# Altium schematic sheet 3.3V CAN_Tranceiver.SchDoc
size A
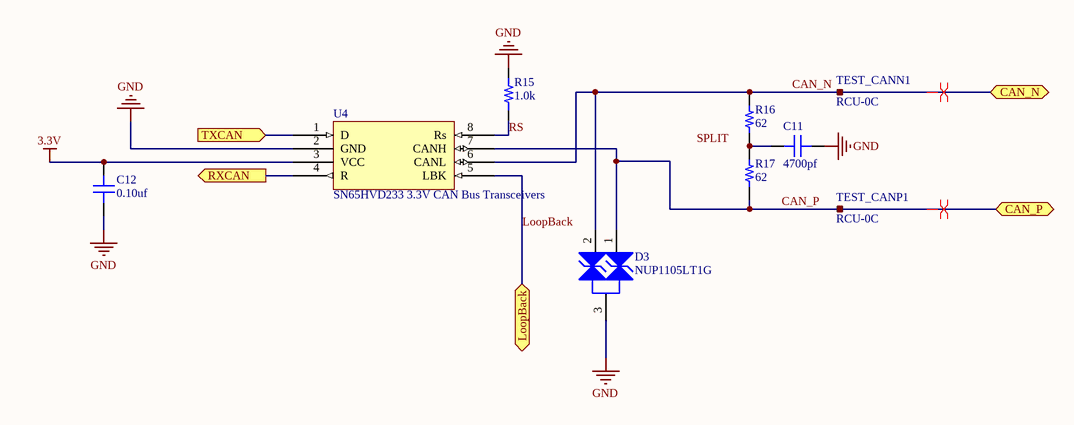
[diagram p0: 3.3V CAN_Tranceiver.SchDoc]

## Parts
C11  value 4700pf  [CAP 0603/1608]  (hidden comment: Capacitor MLCC 4700pf 50V CAP 0603/1608)
C12  value 0.10uf  [CAP 0603/1608]  (hidden comment: Capacitor MLCC 0.10uf 50V CAP 0603/1608)
D3  NUP1105LT1G  [SOT-23 (TO-236)]
R15  value 1.0k  [RES 0603/1608]  (hidden comment: Resistor 1.0k 0603 1/10W 1%)
R16  value 62  [RES 0603/1608]  (hidden comment: Resistor 62 0603 1/10W 5%)
R17  value 62  [RES 0603/1608]  (hidden comment: Resistor 62 0603 1/10W 5%)
TEST_CANN1  RCU-0C  [RCU-0C]
TEST_CANP1  RCU-0C  [RCU-0C]
U4  SN65HVD233 3.3V CAN Bus Transceivers  [SOIC-8]

## Ports
CAN_N (bidir), CAN_P (bidir), LoopBack (bidir), RXCAN (out), TXCAN (in)

## Nets
3.3V: C12.1 U4.3(VCC)
GND: C11.1 C12.2 D3.3(K) R15.2 U4.2(GND)
CAN_N: D3.2(K) R16.1 TEST_CANN1.1 U4.6(CANL) ; port CAN_N
CAN_P: D3.1(K) R17.2 TEST_CANP1.1 U4.7(CANH) ; port CAN_P
LoopBack: U4.5(LBK) ; port LoopBack
RS: R15.1 U4.8(Rs)
RXCAN: U4.4(R) ; port RXCAN
TXCAN: U4.1(D) ; port TXCAN
NetC11_2: C11.2 R16.2 R17.1

## Layout directives
differential pair: CAN_N, CAN_P

## Notes on the sheet
- Labels drawn without touching a wire or pin: SPLIT

## Library data of the parts
C11 = 929: Manufacturer_id: 1; idCapacitor: 929; Name: Cap_4700pf_50V_CAP 0603/1608; Dielectric: Ceramic; Created_By: Nick Mah; Drawer_id: 1; Voltage_Rating: 50V; Package: CAP 0603/1608; Created_Date: 10/20/2018
C12 = 943: Manufacturer_id: 1; idCapacitor: 943; Name: Cap_0.10uf_50V_CAP 0603/1608; Dielectric: Ceramic; Created_By: Nick Mah; Drawer_id: 1; Voltage_Rating: 50V; Package: CAP 0603/1608; Created_Date: 10/20/2018
D3 = 7: ESD Protection Diode; Manufacturer_id: 1; idDiode: 7; Name: SOT-23_350W_Zener; Value: TVS_24V; Type: Zener; Ic: 8A; Power: 350W; Drawer_id: 1; Num_Circuits: 1; Package: SOT-23; MfrPartNo: NUP1105LT1G; Link: https://www.digikey.com/product-detail/en/on-semiconductor/NUP1105LT1G/NUP1105LT1GOSCT-ND/2122067; ComponentLink1URL: https://www.digikey.com/product-detail/en/on-semiconductor/NUP1105LT1G/NUP1105LT1GOSCT-ND/2122067; Supplier1: Digikey; Supplier1PartNo: NUP1105LT1GOSCT-ND
R15 = 289: Manufacturer_id: 1; idResistor: 289; Name: Res_1.0k_0603_1/10W_1%; Created_By: Nick Mah; Supplier 1: Digi-Key; Drawer_id: 1; Tolerance: 1%; Power: 1/10W; Package: 0603; ComponentLink1Description: Datasheet; Created_Date: 2018-10-20
R16 R17 = 1340: Manufacturer_id: 1; idResistor: 1340; Name: Res_62_0603_1/10W_5%; Created_By: Nick Mah; Supplier 1: Digi-Key; Drawer_id: 1; Tolerance: 5%; Power: 1/10W; Package: 0603; ComponentLink1Description: Datasheet; Created_Date: 2018-10-20
TEST_CANN1 TEST_CANP1 = 5: Manufacturer_id: 1; idTable: 5; Name: RCU-0C_Test_Point; Drawer_id: 1; Package: 0603; MfrPartNo: RCU-0C; Link: https://www.digikey.com/product-detail/en/te-connectivity-amp-connectors/RCU-0C/A106145CT-ND/3477802; ComponentLink1Description: Datasheet; ComponentLink1URL: https://www.te.com/commerce/DocumentDelivery/DDEController?Action=srchrtrv&DocNm=1773266&DocType=DS&DocLang=English
U4 = 9: 1/1 Transceiver Half CANbus 8-SOIC; Manufacturer_id: 1; MfrPartNo: SN65HVD233D; idIC_Interface: 9; Name: CAN Transceiver; Value: CAN to UART; Data_Rate: 1Mbps; Vin(Min): 3V; Vin(Max): 3.6V; Drawer_id: 1; Type: Transceiver; Protocol: CAN; Num_Circuits: 1; Package: SOIC-8; Link: https://www.digikey.com/products/en?mpart=SN65HVD233D&v=296; Supplier1: digikey; Supplier1PartNo: 296-14639-5-ND